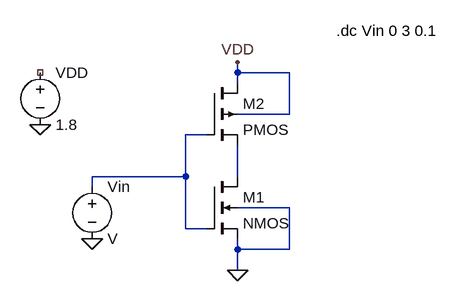
[diagram p0: schematic Draft1.asc]
Draft1.asc, the LTspice schematic file:
Version 4
SHEET 1 880 680
WIRE 416 32 416 16
WIRE 496 32 416 32
WIRE 416 48 416 32
WIRE 496 96 496 32
WIRE 496 96 416 96
WIRE 368 128 336 128
WIRE 336 192 336 128
WIRE 336 192 192 192
WIRE 416 192 416 144
WIRE 192 208 192 192
WIRE 496 240 416 240
WIRE 336 272 336 192
WIRE 368 272 336 272
WIRE 416 304 416 288
WIRE 496 304 496 240
WIRE 496 304 416 304
WIRE 416 336 416 304
FLAG 416 336 0
FLAG 192 288 0
FLAG 112 112 0
FLAG 416 16 VDD
SYMBOL nmos4 368 192 R0
SYMATTR InstName M1
SYMBOL pmos4 368 48 R0
SYMATTR InstName M2
SYMBOL Voltage 112 16 R0
SYMATTR InstName VDD
SYMATTR Value 1.8
SYMBOL Voltage 192 192 R0
SYMATTR InstName Vin
TEXT 568 -32 Left 2 !.dc Vin 0 3 0.1

The netlist it stands for:
* Draft1.asc
M1 N002 N001 0 0 NMOS
M2 VDD N001 N002 VDD PMOS
VDD NC_01 0 1.8
Vin N001 0 V
.model NMOS NMOS
.model PMOS PMOS
.lib standard.mos
.dc Vin 0 3 0.1
.backanno
.end